# EAGLE design 114_uv (EAGLE 9.6.0)
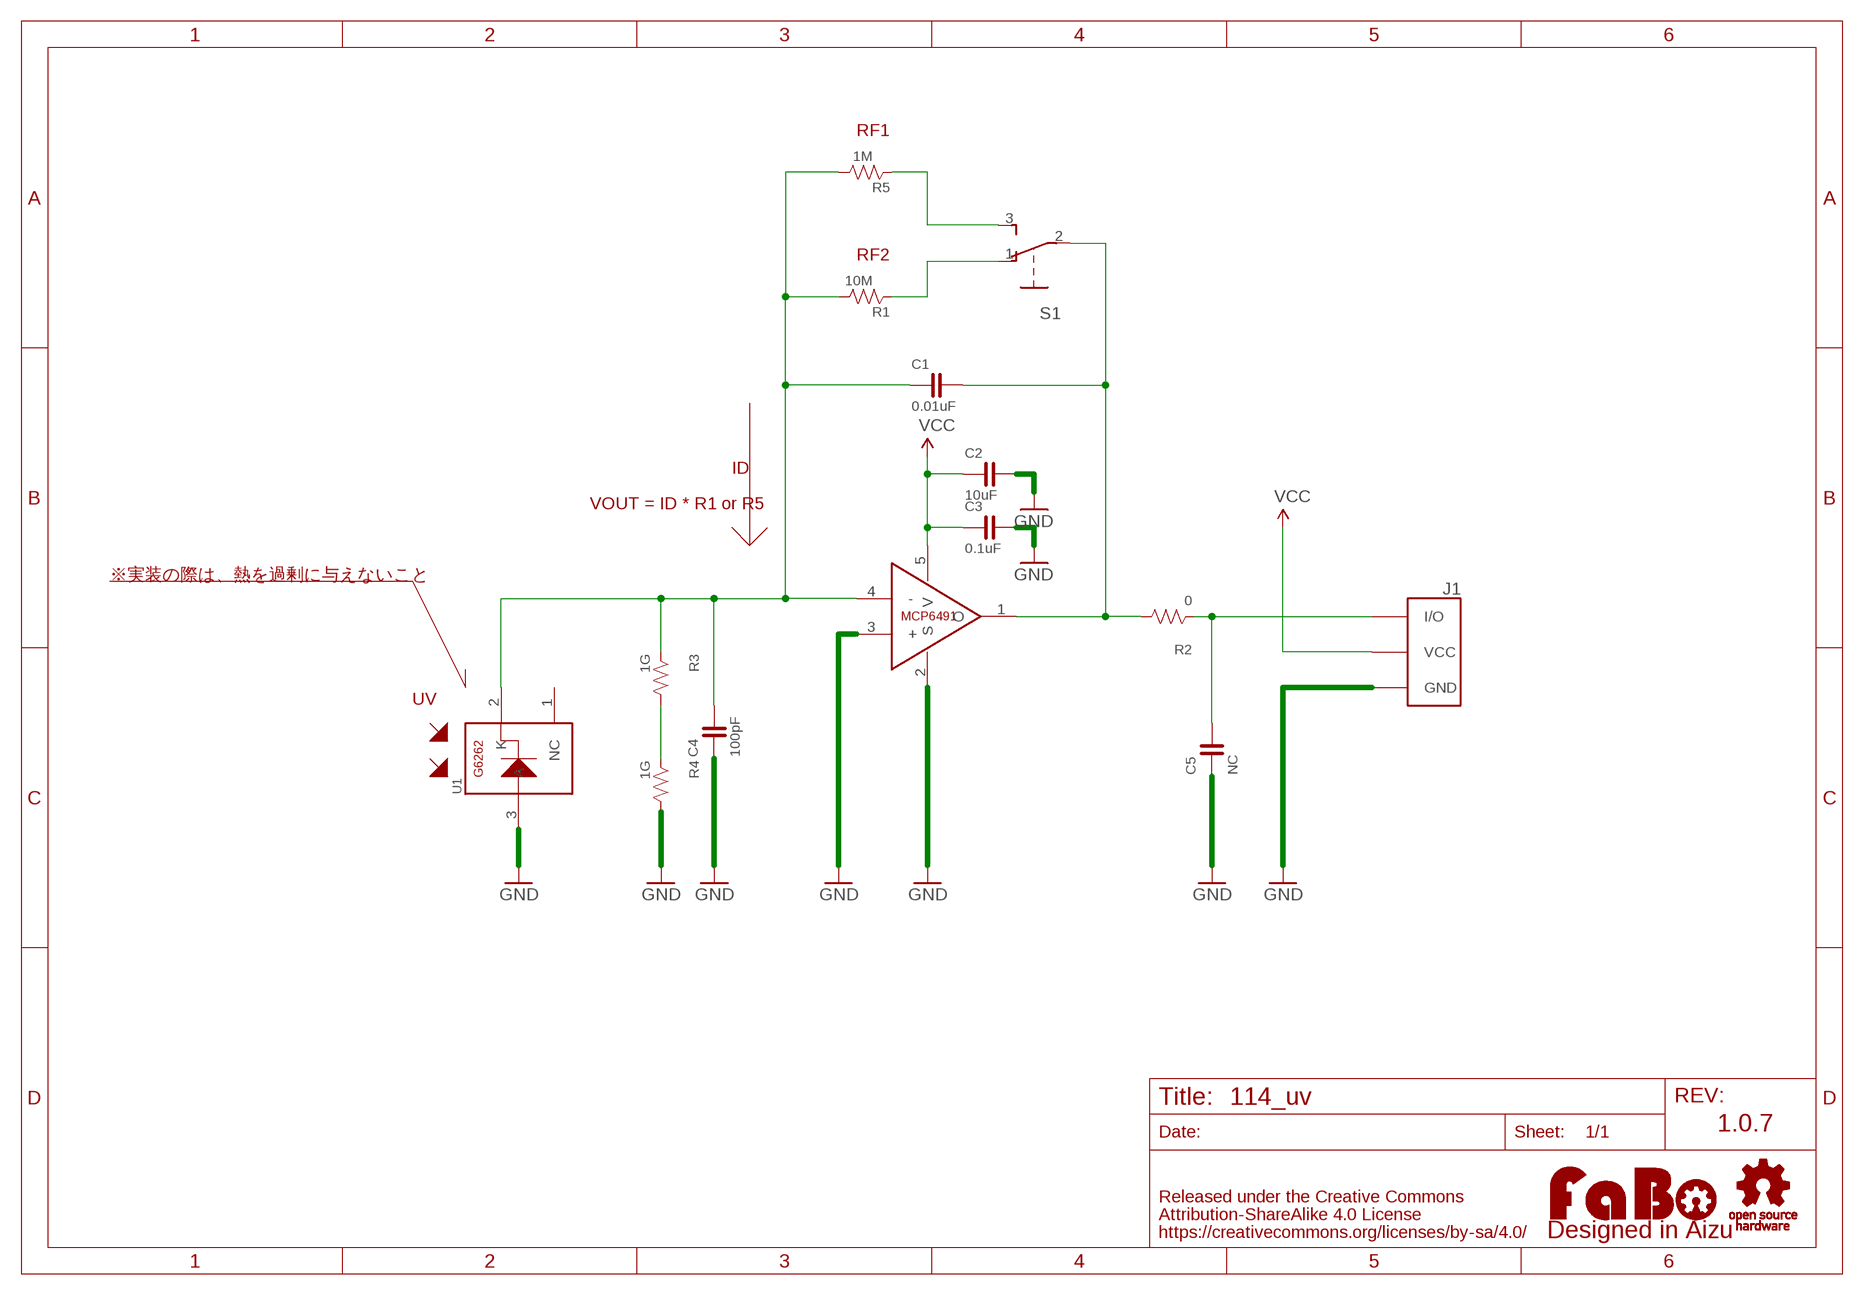
[diagram p0: schematic, sheet 1]

## Parts
C1  0.01uF  CAPACITOR-0603_NARROW  [0603-NARROW]
C2  10uF  CAPACITOR-0603_NARROW  [0603-NARROW]
C3  0.1uF  CAPACITOR-0603_NARROW  [0603-NARROW]
C4  100pF  CAPACITOR-0603_NARROW  [0603-NARROW]
C5  NC  CAPACITOR-0603_NARROW  [0603-NARROW]
J1  PA-3  FABO_BRICK_3PIN  [FABO_BRICK_3PIN]
LOGO1  LOGO_FABO-M  [LOGO_FABO_M]
R1  10M  RESISTOR-0603  [0603]
R2  0  RESISTOR-0603  [0603]
R3  1G  RESISTOR-0603  [0603]
R4  1G  RESISTOR-0603  [0603]
R5  1M  RESISTOR-0603  [0603]
S1  SLIDE-SSSS810701  [SSSS810701]
U1  G6262  HAMAMATSU-GAASP-G6262  [GAASP-G6262]
U$2  OPENLOGO  LOGO_OSHW-M_BOTTOM  [LOGO_OSHW_M_BOTTOM]
U$4  MCP6491  [SOT-23]

## Nets
GND: C2.2 C3.2 C4.1 C5.1 J1.GND R4.2 U1.3(A) U$4.2(S) U$4.3(+)
N$1: C1.1 C4.2 R1.2 R3.1 R5.2 U1.2(K) U$4.4(-)
N$2: C5.2 J1.I/O R2.1
N$3: R3.2 R4.1
N$4: C1.2 R2.2 S1.2 U$4.1(O)
N$5: R5.1 S1.3
N$6: R1.1 S1.1
VCC: C2.1 C3.1 J1.VCC U$4.5(V)
Unconnected: U1.1(NC)

## Notes on the sheet
- RF1
- RF2
- ID
- VOUT = ID * R1 or R5
- ※実装の際は、熱を過剰に与えないこと
- UV
- 1.0.7

## Library data of the parts
C1-C5 = FaBo-Capacitor:CAPACITOR: CAPACITOR
J1 = FaBo-Template:FABO_BRICK_3PIN: FaBo Brick 3pin
LOGO1 = component:LOGO_FABO
R1 R3-R5 = FaBo-Resistors:RESISTOR: RESISTOR; SPICEPREFIX: R
R2 = FaBo-Resistors:RESISTOR: RESISTOR
S1 = FaBo-Switch:SLIDE: EG1218 E-SWICTH Series EG-Swicthes <https://www.e-switch.com/system/asset/product_line/data_sheet/119/EG.pdf> Distributor SSSS810701 Alps SSSS8 Series <http://www.alps.com/prod/info/J/HTML/Switch/Slide/SSSS8/SSSS810701.html> Octoatrs <https://octopart.com/search?q=SSSS810701+>
U1 = FaBo-Sensor:HAMAMATSU-GAASP-G6262: GaAsP G6262
U$2 = FaBo-etc:LOGO_OSHW
U$4 = FaBo-Opamp:MCP6491

## Board
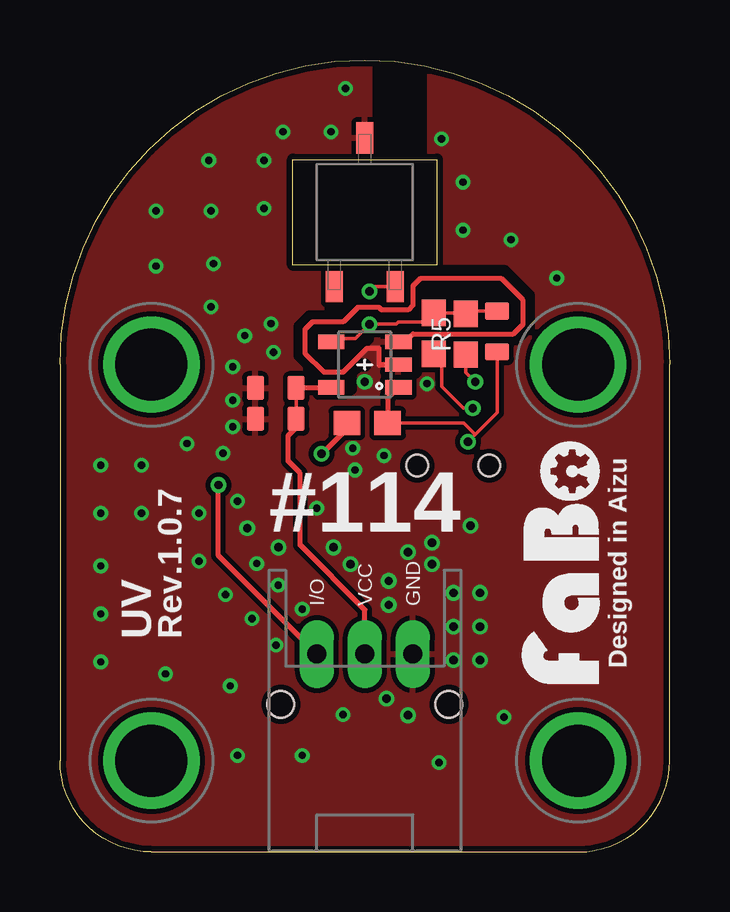
[diagram p1: board, top side]
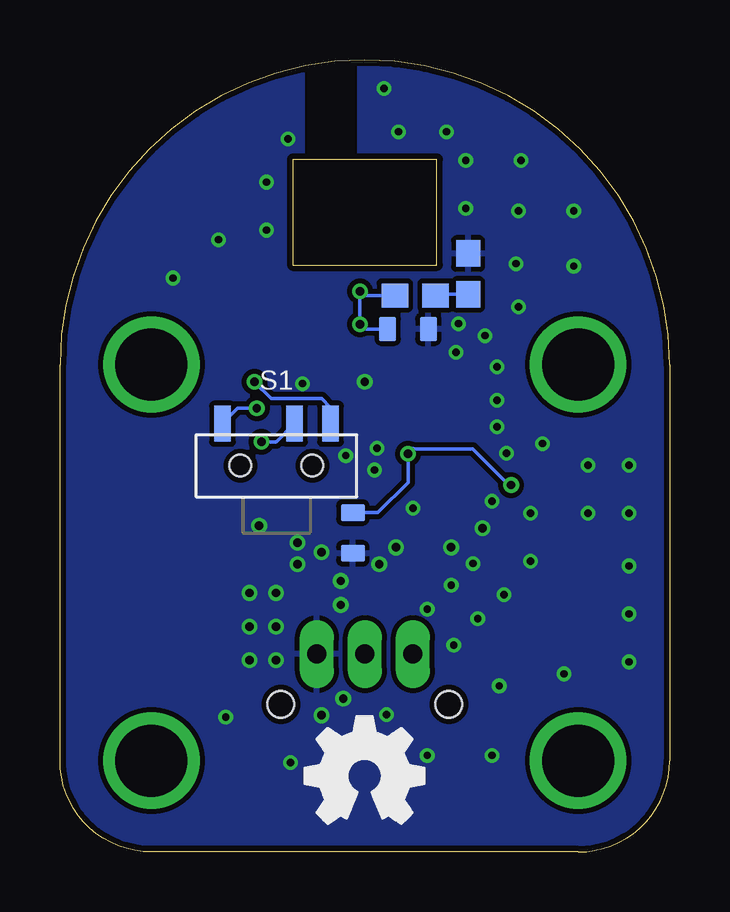
[diagram p2: board, bottom side, seen from below]

Size 25.4 x 33.02 mm. Coordinates in mm from the lower left corner, seen from the top.
Copper layers (1*16): Top 0.035mm / dielectric 1.6mm / Bottom 0.035mm
Design rules "PCBway": minimum track width 6mil, minimum drill 12mil, track to track 6mil, track to pad 6mil, pad to pad 6mil, via to via 6mil, smd to smd 6mil, copper to edge 10mil, drill to drill 10mil, minimum pad ring 10mil, minimum via ring 6mil, stop-mask expansion 2mil, vias tented up to drill 100mil, thermal gap 8mil
tRestrict: area 13.3,28.8 to 15,34.2; 95 lines
bRestrict: area 13.3,28.8 to 14.9,34.3

### Footprints (pad centres in the part's own frame; a part is rotated, then mirrored left to right if it is on the bottom)
0603-NARROW = smd 0.71 x 1: 1 -0.85,0; 2 0.85,0
FABO_BRICK_3PIN = drill 0.8 pad 1.422 long: GND 2,-8.255; I/O -2,-8.255; VCC 0,-8.255 | drill 3 pad 3.81: P$1 -8.89,3.81; P$2 8.89,3.81; P$3 -8.89,-12.7; P$4 8.89,-12.7 | hole 1.1: -3.5,-10.355; 3.5,-10.355
0603 = smd 1.1 x 1: 1 -0.85,0; 2 0.85,0
SSSS810701 = smd 0.7 x 1.5: 1 -2.25,1.75; 2 0.75,1.75; 3 2.25,1.75 | hole 0.9: -1.5,0; 1.5,0
GAASP-G6262 = smd 0.7 x 1.3: 1 -1.27,-3.104; 2 1.27,-3.104; 3 0,3.104
SOT-23 = smd 0.6 x 1.1: 1 -0.95,-1.4; 2 0,-1.4; 3 0.95,-1.4; 4 0.95,1.4; 5 -0.95,1.4

### Placement (x,y rotation side)
C1  18.21,21.7 270 top
C2  8.99,18.05 180 top
C3  8.99,19.35 180 top
C4  10.9,21.8 180 bottom
C5  13.2,13.3 90 bottom
J1  12.7,16.51 0 top
LOGO1  22.86,12.06 90 top
R1  15.57,21.62 90 top
R2  12.8,17.88 0 top
R3  10.6,23.2 0 bottom
R4  8.4,24.1 90 bottom
R5  16.91,21.59 90 top
S1  16.38,16.11 0 bottom
U1  12.7,26.67 0 top
U$2  12.7,3.17 0 top
U$4  12.7,20.32 90 top

### Tracks (layer width: path | path; a pad name or v marks a point on that pad's centre or on a via)
GND  (via drill 0.3, 0.35)
  Top 0.152: U$4.3 14.37,21.27
  Top 0.203: 14.37,21.27 14.7,21.6 18.88,21.6 19.29,22.01 19.29,23.01 18.4,23.9 15,23.9 14.7,23.6 14.7,22.8 14.5,22.6 13.4,22.6 13.3,22.7 12.4,22.7 11.8,22.1 10.52,22.1 10.2,21.78 10.2,20.8 11,20 11.8,20 12.8,21 13.3,21 13.3,20.3 14.08,20.3 U$4.2
  other vias: 12.7,19.6 7.8,13.5 7.7,21.53 7.2,20.23 7.2,18.83 15.5,12 13.7,11.3 14.5,12.5 13.6,6.4 14.5,5.7 16.4,8 16.4,9.4 17.5,9.4 17.5,8 15.5,12.9 17.1,13.6 16.4,10.8 17.5,10.8 12.3,15.93 7.2,17.73 6.8,16.63 5.8,14.13 5.8,12.13 6.9,10.73 8,9.73 9,8.63 8.2,12.03 9.1,11.13 10.1,10.13 7.4,14.63 11.3,30.03 9.3,30.03 8.5,28.83 8.5,26.83 15.9,29.73 11.9,31.83 16.8,27.93 16.8,25.93 18.8,25.53 20.7,23.93 8.8,22.03 8.9,20.83 11.4,12.7 12.1,12 9.1,12.7 13.7,10.3 6.3,26.73 6.2,28.83 4,26.73 6.4,24.53 4,24.43 6.3,22.73 5.3,17.03 1.7,16.13 1.7,14.13 1.7,11.93 3.4,14.13 3.4,16.13 11.8,5.73 7.1,6.93 7.4,4.03 4.4,7.43 1.7,9.93 1.7,7.93 13.5,16.53 10.1,4.03 15.8,3.73 18.5,5.63 15.3,19.53 10.7,14.33 12.2,16.83
  pour Bottom (isolate 0.203): 0,0 25.4,0 25.4,33.02 0,33.02
  pour Top (isolate 0.203): 0,0 25.4,0 25.4,33.02 0,33.02
N$1  (via drill 0.35)
  Top 0.152: R1.2 15.21,22.1 14.1,22.1 14,22 v12.9,22 12.3,21.4 11.43,21.4 U$4.4 | R1.2 15.65,22.55 | v12.9,23.37 13.09,23.57 U1.2 | R1.2 16.88,22.47 R5.2 | R5.2 16.97,22.5 | R5.2 17.02,22.55 C1.1
  Bottom 0.152: R3.1 12.73,23.2 v12.9,23.37 v12.9,22 12.7,21.8 C4.2
N$2  (via drill 0.35)
  Top 0.203: R2.1 11.9,17.83 11.9,17.6 v10.9,16.6 | J1.I/O 6.6,12.36 v6.6,15.3
  Bottom 0.152: 10.7,16.8 8.2,16.8 6.7,15.3 v6.6,15.3 | C5.2 12.15,14.15 10.9,15.4 v10.9,16.6
  Bottom 0.203: v10.9,16.6 10.7,16.8
N$3
  Bottom 0.152: R4.1 9.7,23.25 R3.2
N$4  (via drill 0.35)
  Top 0.152: C1.2 18.21,18.32 17.3,17.4 | 17.3,17.4 v17,17.1 | R2.2 16.82,17.88 17.3,17.4
  Top 0.203: 14.2,19.47 U$4.1 13.65,18.92 R2.2
  Bottom 0.152: v17,17.1 16.39,17.1 S1.2
N$5  (via drill 0.35)
  Top 0.152: v17.3,19.6 16.91,19.99 R5.1
  Bottom 0.152: S1.3 14.13,18.53 14.5,18.9 16.6,18.9 v17.3,19.6
N$6  (via drill 0.35)
  Top 0.152: R1.1 15.9,20.45 15.9,19.4 16.8,18.5 v17.2,18.5
  Bottom 0.152: v17.2,18.5 17.98,18.5 S1.1
VCC
  Top 0.152: 9.84,17.7 C2.1 C3.1
  Top 0.203: U$4.5 11.28,19.35 C3.1 | J1.VCC 12.7,10.1 10,12.8 10,15.8 9.5,16.3 9.5,17.36 9.84,17.7

### Text on the board
tPlace: #114 | Designed in Aizu | UV | Rev.1.0.7